# EAGLE design chaves_30 (EAGLE 7.6.0)
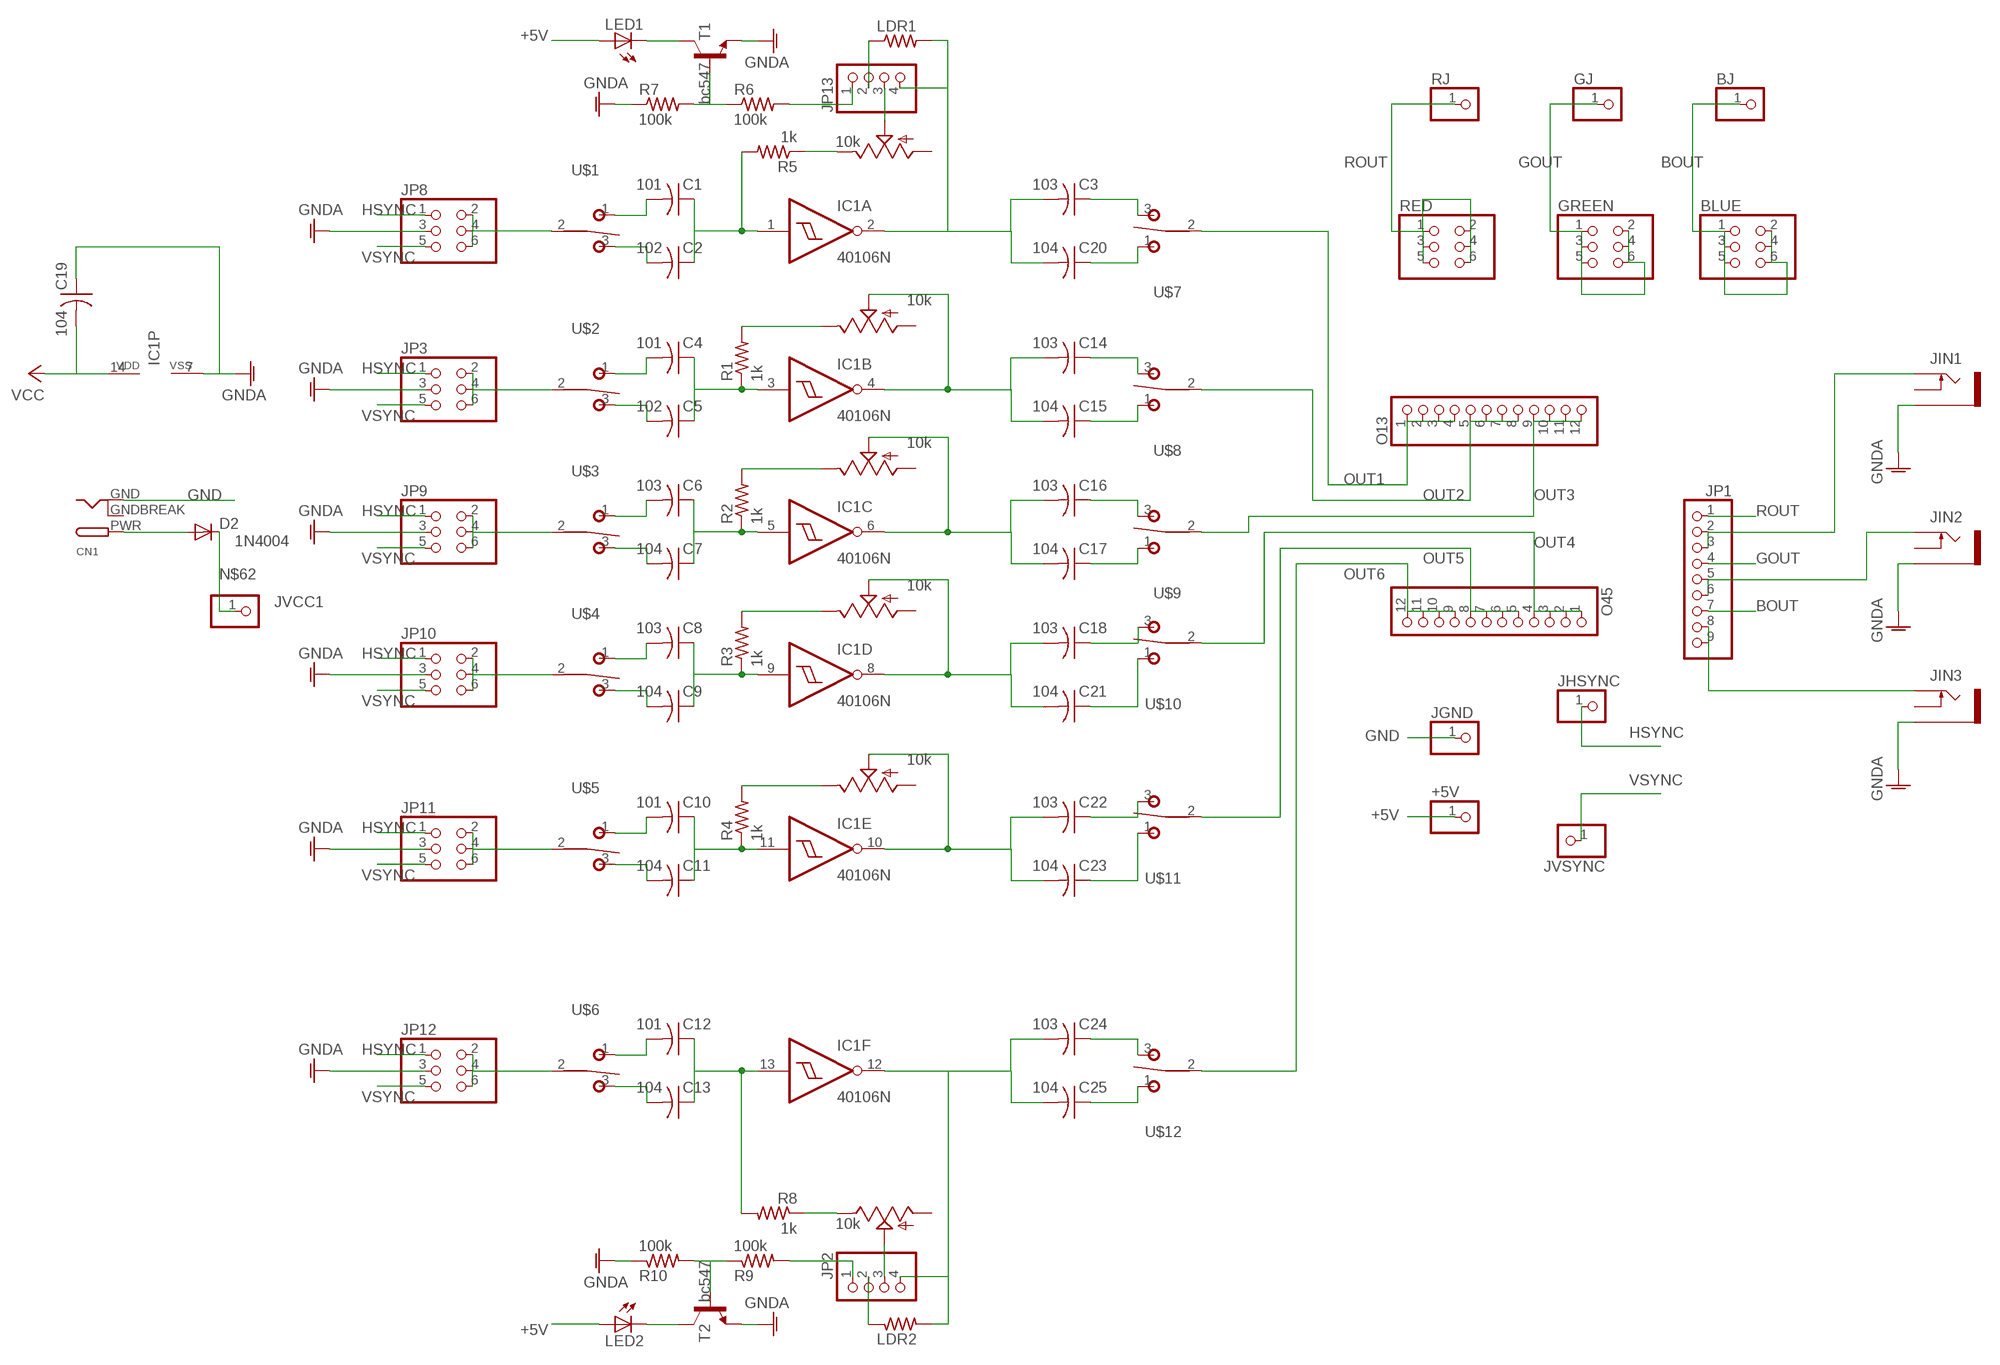
[diagram p0: schematic, sheet 1]

## Parts
+5V  PINHD-1X1  [1X01]
BJ  PINHD-1X1  [1X01]
BLUE  PINHD-2X3  [2X03]
C1  101  C-US050-025X075  [C050-025X075]
C2  102  C-US050-025X075  [C050-025X075]
C3  103  C-US050-025X075  [C050-025X075]
C4  101  C-US050-025X075  [C050-025X075]
C5  102  C-US050-025X075  [C050-025X075]
C6  103  C-US050-025X075  [C050-025X075]
C7  104  C-US050-025X075  [C050-025X075]
C8  103  C-US050-025X075  [C050-025X075]
C9  104  C-US050-025X075  [C050-025X075]
C10  101  C-US050-025X075  [C050-025X075]
C11  104  C-US050-025X075  [C050-025X075]
C12  101  C-US050-025X075  [C050-025X075]
C13  104  C-US050-025X075  [C050-025X075]
C14  103  C-US050-025X075  [C050-025X075]
C15  104  C-US050-025X075  [C050-025X075]
C16  103  C-US050-025X075  [C050-025X075]
C17  104  C-US050-025X075  [C050-025X075]
C18  103  C-US050-025X075  [C050-025X075]
C19  104  C-US050-025X075  [C050-025X075]
C20  104  C-US050-025X075  [C050-025X075]
C21  104  C-US050-025X075  [C050-025X075]
C22  103  C-US050-025X075  [C050-025X075]
C23  104  C-US050-025X075  [C050-025X075]
C24  103  C-US050-025X075  [C050-025X075]
C25  104  C-US050-025X075  [C050-025X075]
CN1  DCBARRELPTH  [DCJACK_2MM_PTH]
D2  1N4004  [DO41-10]
GJ  PINHD-1X1  [1X01]
GREEN  PINHD-2X3  [2X03]
IC1  40106N  [DIL14]
JGND  PINHD-1X1  [1X01]
JHSYNC  PINHD-1X1  [1X01]
JIN1  PJ302M  [PJ302M]
JIN2  PJ302M  [PJ302M]
JIN3  PJ302M  [PJ302M]
JP1  PINHD-1X9  [1X09-BIG]
JP2  PINHD-1X4  [1X04]
JP3  PINHD-2X3  [2X03]
JP8  PINHD-2X3  [2X03]
JP9  PINHD-2X3  [2X03]
JP10  PINHD-2X3  [2X03]
JP11  PINHD-2X3  [2X03]
JP12  PINHD-2X3  [2X03]
JP13  PINHD-1X4  [1X04]
JVCC1  PINHD-1X1  [1X01]
JVSYNC  PINHD-1X1  [1X01]
LDR1  R-US_0204/2V  [0204V]
LDR2  R-US_0204/2V  [0204V]
LED1  LED5MM  [LED5MM]
LED2  LED5MM  [LED5MM]
O13  PINHD-1X12-CB  [1X12-CB]
O45  PINHD-1X12-CB  [1X12-CB]
POT1  10k  POT_USVERTICAL  [ALPS_POT_VERTICAL]
POT2  10k  POT_USVERTICAL  [ALPS_POT_VERTICAL]
POT3  10k  POT_USVERTICAL  [ALPS_POT_VERTICAL]
POT4  10k  POT_USVERTICAL  [ALPS_POT_VERTICAL]
POT5  10k  POT_USVERTICAL  [ALPS_POT_VERTICAL]
POT6  10k  POT_USVERTICAL  [ALPS_POT_VERTICAL]
R1  1k  R-US_0204/2V  [0204V]
R2  1k  R-US_0204/2V  [0204V]
R3  1k  R-US_0204/2V  [0204V]
R4  1k  R-US_0204/2V  [0204V]
R5  1k  R-US_0204/2V  [0204V]
R6  100k  R-US_0204/2V  [0204V]
R7  100k  R-US_0204/2V  [0204V]
R8  1k  R-US_0204/2V  [0204V]
R9  100k  R-US_0204/2V  [0204V]
R10  100k  R-US_0204/2V  [0204V]
RED  PINHD-2X3  [2X03]
RJ  PINHD-1X1  [1X01]
T1  bc547  -NPN-TO92-ECB  [TO92-ECB]
T2  bc547  -NPN-TO92-ECB  [TO92-ECB]
U$1  T-80-T-SPDT-ON-OFF-ON  [M9040P]
U$2  T-80-T-SPDT-ON-OFF-ON  [M9040P]
U$3  T-80-T-SPDT-ON-OFF-ON  [M9040P]
U$4  T-80-T-SPDT-ON-OFF-ON  [M9040P]
U$5  T-80-T-SPDT-ON-OFF-ON  [M9040P]
U$6  T-80-T-SPDT-ON-OFF-ON  [M9040P]
U$7  T-80-T-SPDT-ON-OFF-ON  [M9040P]
U$8  T-80-T-SPDT-ON-OFF-ON  [M9040P]
U$9  T-80-T-SPDT-ON-OFF-ON  [M9040P]
U$10  T-80-T-SPDT-ON-OFF-ON  [M9040P]
U$11  T-80-T-SPDT-ON-OFF-ON  [M9040P]
U$12  T-80-T-SPDT-ON-OFF-ON  [M9040P]

## Nets
+5V: +5V.1 C19.2 IC1.14(P:VDD) LED1.A LED2.A ; supply symbol labelled VCC
BOUT: BJ.1 BLUE.1 BLUE.2 BLUE.3 BLUE.4 BLUE.5 BLUE.6 JP1.7
GND: C19.1 CN1.GND IC1.7(P:VSS) JGND.1 JIN1.GND(SLEEVE) JIN2.GND(SLEEVE) JIN3.GND(SLEEVE) JP3.3 JP8.3 JP9.3 JP10.3 JP11.3 JP12.3 R7.1 R10.1 T1.E T2.E ; supply symbol labelled GNDA
GOUT: GJ.1 GREEN.1 GREEN.2 GREEN.3 GREEN.4 GREEN.5 GREEN.6 JP1.4
HSYNC: JHSYNC.1 JP3.1 JP8.1 JP9.1 JP10.1 JP11.1 JP12.1
N$1: C1.2 U$1.1(O)
N$2: C2.2 U$1.3(S)
N$3: JP13.2 LDR1.1
N$4: C5.2 U$2.3(S)
N$5: C4.2 U$2.1(O)
N$6: JP13.3 POT1.P$2(S)
N$7: C8.2 U$4.1(O)
N$8: C9.2 U$4.3(S)
N$9: JIN1.TIP JP1.2 JP1.3
N$10: C6.2 U$3.1(O)
N$11: C7.2 U$3.3(S)
N$12: JIN2.TIP JP1.5 JP1.6
N$13: JIN3.TIP JP1.8 JP1.9
N$14: JP3.2 JP3.4 JP3.6 U$2.2(P)
N$16: C20.1 U$7.1(O)
N$17: C3.1 U$7.3(S)
N$19: POT1.P$1(E) R5.1
N$20: JP8.2 JP8.4 JP8.6 U$1.2(P)
N$22: POT2.P$1(E) R1.2
N$23: JP9.2 JP9.4 JP9.6 U$3.2(P)
N$24: C15.1 U$8.1(O)
N$26: C14.1 U$8.3(S)
N$28: C17.1 U$9.1(O)
N$29: C16.1 U$9.3(S)
N$31: JP10.2 JP10.4 JP10.6 U$4.2(P)
N$32: R6.1 R7.2 T1.B
N$33: POT3.P$1(E) R2.2
N$34: JP13.1 R6.2
N$35: JP11.2 JP11.4 JP11.6 U$5.2(P)
N$36: JP12.2 JP12.4 JP12.6 U$6.2(P)
N$37: C21.1 U$10.1(O)
N$38: C18.1 U$10.3(S)
N$40: C23.1 U$11.1(O)
N$41: C22.1 U$11.3(S)
N$43: C25.1 U$12.1(O)
N$44: C24.1 U$12.3(S)
N$46: C10.2 U$5.1(O)
N$47: POT4.P$1(E) R3.2
N$48: C11.2 U$5.3(S)
N$49: C13.2 U$6.3(S)
N$50: C12.2 U$6.1(O)
N$52: LED1.K(C) T1.C
N$53: POT5.P$1(E) R4.2
N$55: C24.2 C25.2 IC1.12(F:O) JP2.4 LDR2.2
N$56: JP2.2 LDR2.1
N$57: JP2.3 POT6.P$2(S)
N$58: POT6.P$1(E) R8.1
N$59: R9.1 R10.2 T2.B
N$60: JP2.1 R9.2
N$61: LED2.K(C) T2.C
N$62: D2.C JVCC1.1
N$101: C3.2 C20.2 IC1.2(A:O) JP13.4 LDR1.2
N$102: C14.2 C15.2 IC1.4(B:O) POT2.P$2(S)
N$103: C16.2 C17.2 IC1.6(C:O) POT3.P$2(S)
N$104: C18.2 C21.2 IC1.8(D:O) POT4.P$2(S)
N$105: C22.2 C23.2 IC1.10(E:O) POT5.P$2(S)
OUT1: O13.1 O13.2 O13.3 O13.4 U$7.2(P)
OUT2: O13.5 O13.6 O13.7 O13.8 U$8.2(P)
OUT3: O13.9 O13.10 O13.11 O13.12 U$9.2(P)
OUT4: O45.1 O45.2 O45.3 O45.4 U$10.2(P)
OUT5: O45.5 O45.6 O45.7 O45.8 U$11.2(P)
OUT6: O45.9 O45.10 O45.11 O45.12 U$12.2(P)
ROUT: JP1.1 RED.1 RED.2 RED.3 RED.4 RED.5 RED.6 RJ.1
SS1: C1.1 C2.1 IC1.1(A:I) R5.2
SS2: C4.1 C5.1 IC1.3(B:I) R1.1
SS3: C6.1 C7.1 IC1.5(C:I) R2.1
SS4: C8.1 C9.1 IC1.9(D:I) R3.1
SS5: C10.1 C11.1 IC1.11(E:I) R4.1
SS6: C12.1 C13.1 IC1.13(F:I) R8.2
VIN: CN1.PWR D2.A
VSYNC: JP3.5 JP8.5 JP9.5 JP10.5 JP11.5 JP12.5 JVSYNC.1
Unconnected: JIN1.SW(SWITCH) JIN2.SW(SWITCH) JIN3.SW(SWITCH) POT1.P$3(A) POT2.P$3(A) POT3.P$3(A) POT4.P$3(A) POT5.P$3(A) POT6.P$3(A)

## Power pins joined to a net without a drawn wire
GNDBREAK: CN1.GNDBREAK

## Library data of the parts
+5V BJ GJ JGND JHSYNC JVCC1 JVSYNC RJ = adafruit:PINHD-1X1: Pin header 1x1 for 0.1" spacing With round pins
BLUE GREEN JP3 JP8-JP12 RED = pinhead:PINHD-2X3: PIN HEADER
C1-C25 = adafruit:C-US: CAPACITOR, American symbol
CN1 = adafruit:DCBARREL: 2.0mm DC Barrel Jack DCJACK_2MM_PTH - Through Hole Jack (4UConnector: 05537)
D2 = diode:1N4004: DIODE general purpose rectifier, 1 A
IC1 = 40xx:40106: Hex SCHMITT TRIGGER
JIN1-JIN3 = pj302m:PJ302M: PJ302M horizontal / right angled mount 3.5 mm jack socket
JP1 = adafruit:PINHD-1X9: Pin header 1x10 0.1" spacing With round pins
JP2 JP13 = pinhead:PINHD-1X4: PIN HEADER
LDR1 LDR2 R1-R10 = adafruit:R-US_: RESISTOR, American symbol
LED1 LED2 = adafruit:LED: LED OSRAM: - CHIPLED LG R971, LG N971, LY N971, LG Q971, LY Q971, LO R971, LY R971 LH N974, LH R974 LS Q976, LO Q976, LY Q976 LO Q996 - Hyper CHIPLED LW Q18S LB Q993, LB Q99A, LB R99A - SideLED LS A670, LO A670, LY A670, LG A670, LP A670 LB A673, LV A673, LT A673, LW A673 LH A674 LY A675 LS A676, LA A676, LO A676, LY A676, LW A676 LS A679, LY A679, LG A679 - Hyper Micro SIDELED® LS Y876, LA Y876, LO Y876, LY Y876 LT Y87S - SmartLED LW L88C, LW L88S LB L89C, LB L89S, LG L890 LS L89K, LO L89K, LY L89K LS L896, LA L896, LO L896, LY L896 - TOPLED LS T670, LO T670, LY T670, LG T670, LP T670 LSG T670, LSP T670, LSY T670, LOP T670, LYG T670 LG T671, LOG T671, LSG T671 LB T673, LV T673, LT T673, LW T673 LH T674 LS T676, LA T676, LO T676, LY T676, LB T676, LH T676, LSB T676, LW T676 LB T67C, LV T67C, LT T67C, LS T67K, LO T67K, LY T67K, LW E67C LS E67B, LA E67B, LO E67B, LY E67B, LB E67C, LV E67C, LT E67C LW T67C LS T679, LY T679, LG T679 LS T770, LO T770, LY T770, LG T770, LP T770 LB T773, LV T773, LT T773, LW T773 LH T774 LS E675, LA E675, LY E675, LS T675 LS T776, LA T776, LO T776, LY T776, LB T776 LHGB T686 LT T68C, LB T68C - Hyper Mini TOPLED® LB M676 - Mini TOPLED Santana® LG M470 LS M47K, LO M47K, LY M47K Source: http://www.osram.convergy.de/
O13 O45 = adafruit:PINHD-1X12: PIN HEADER
POT1-POT6 = pot-alps:POT_US
T1 T2 = MusicThingModular:*-NPN-: NPN Transistror BF959 corrected 2008.03.06
U$1-U$12 = MusicThingModular:T-80-T-SPDT-ON-OFF-ON

## Board
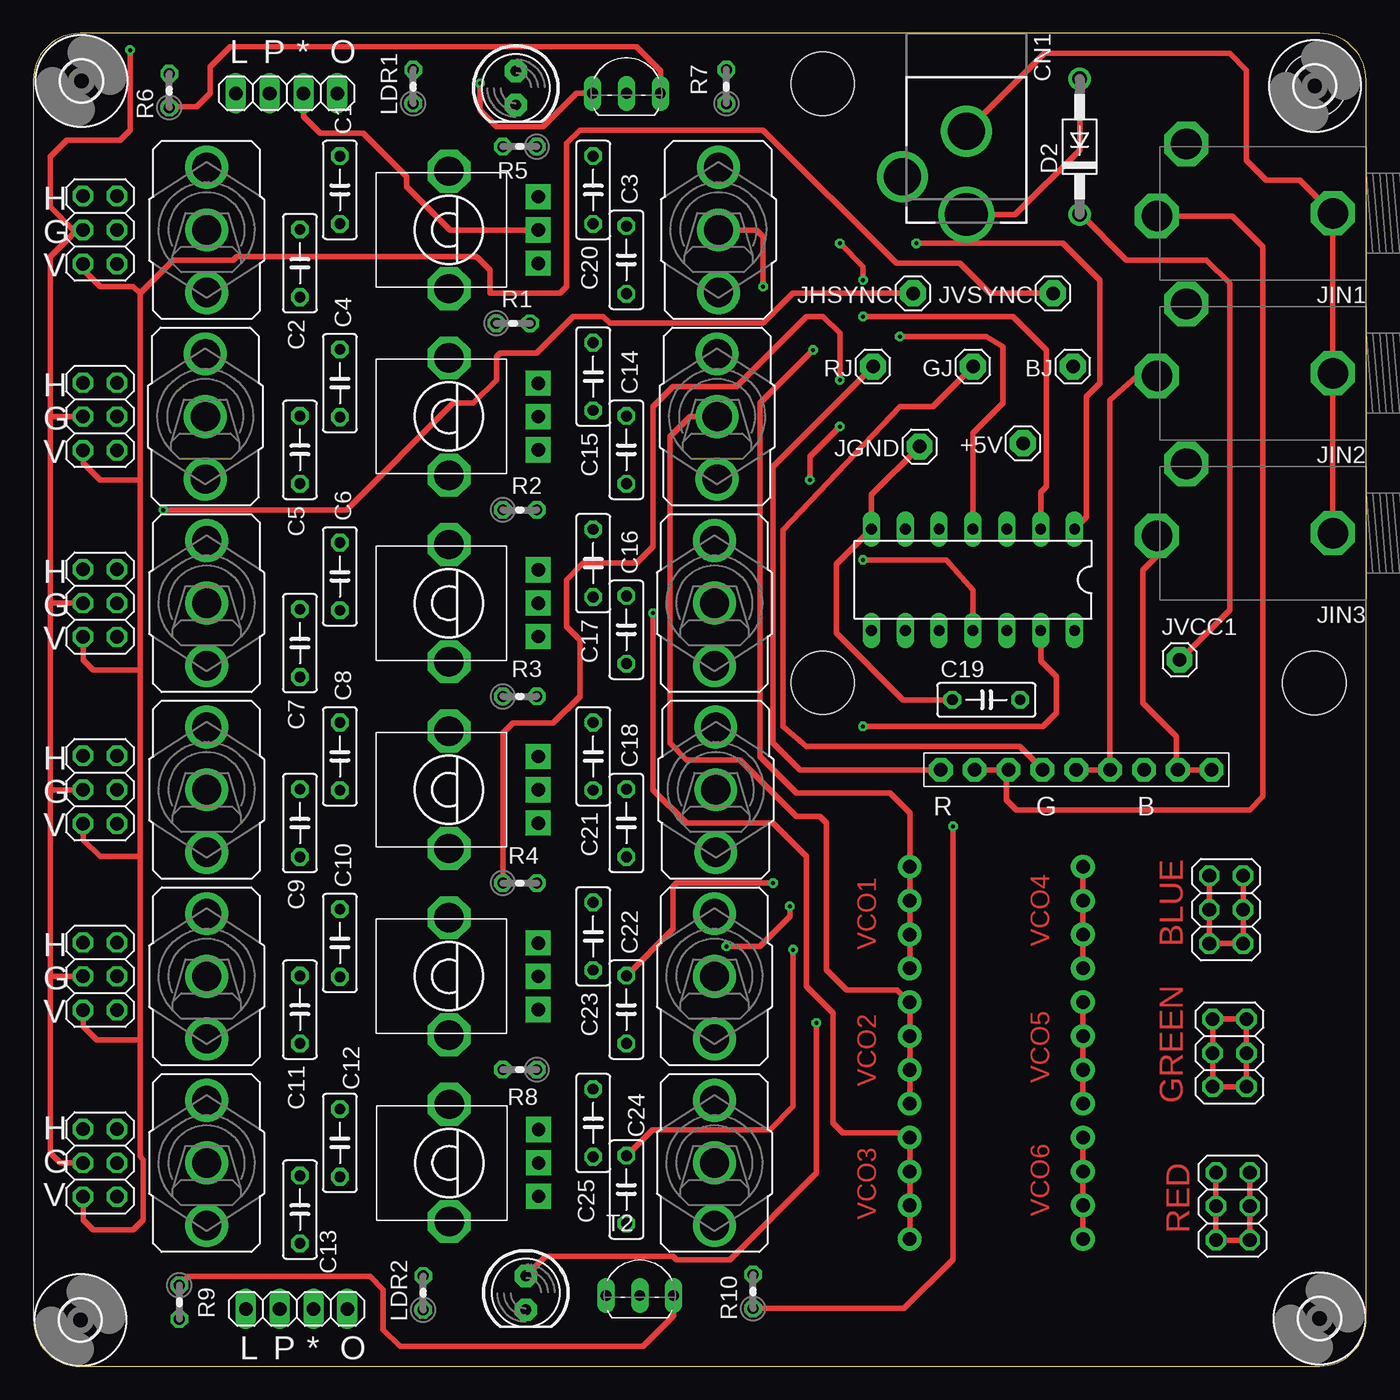
[diagram p1: board, top side]
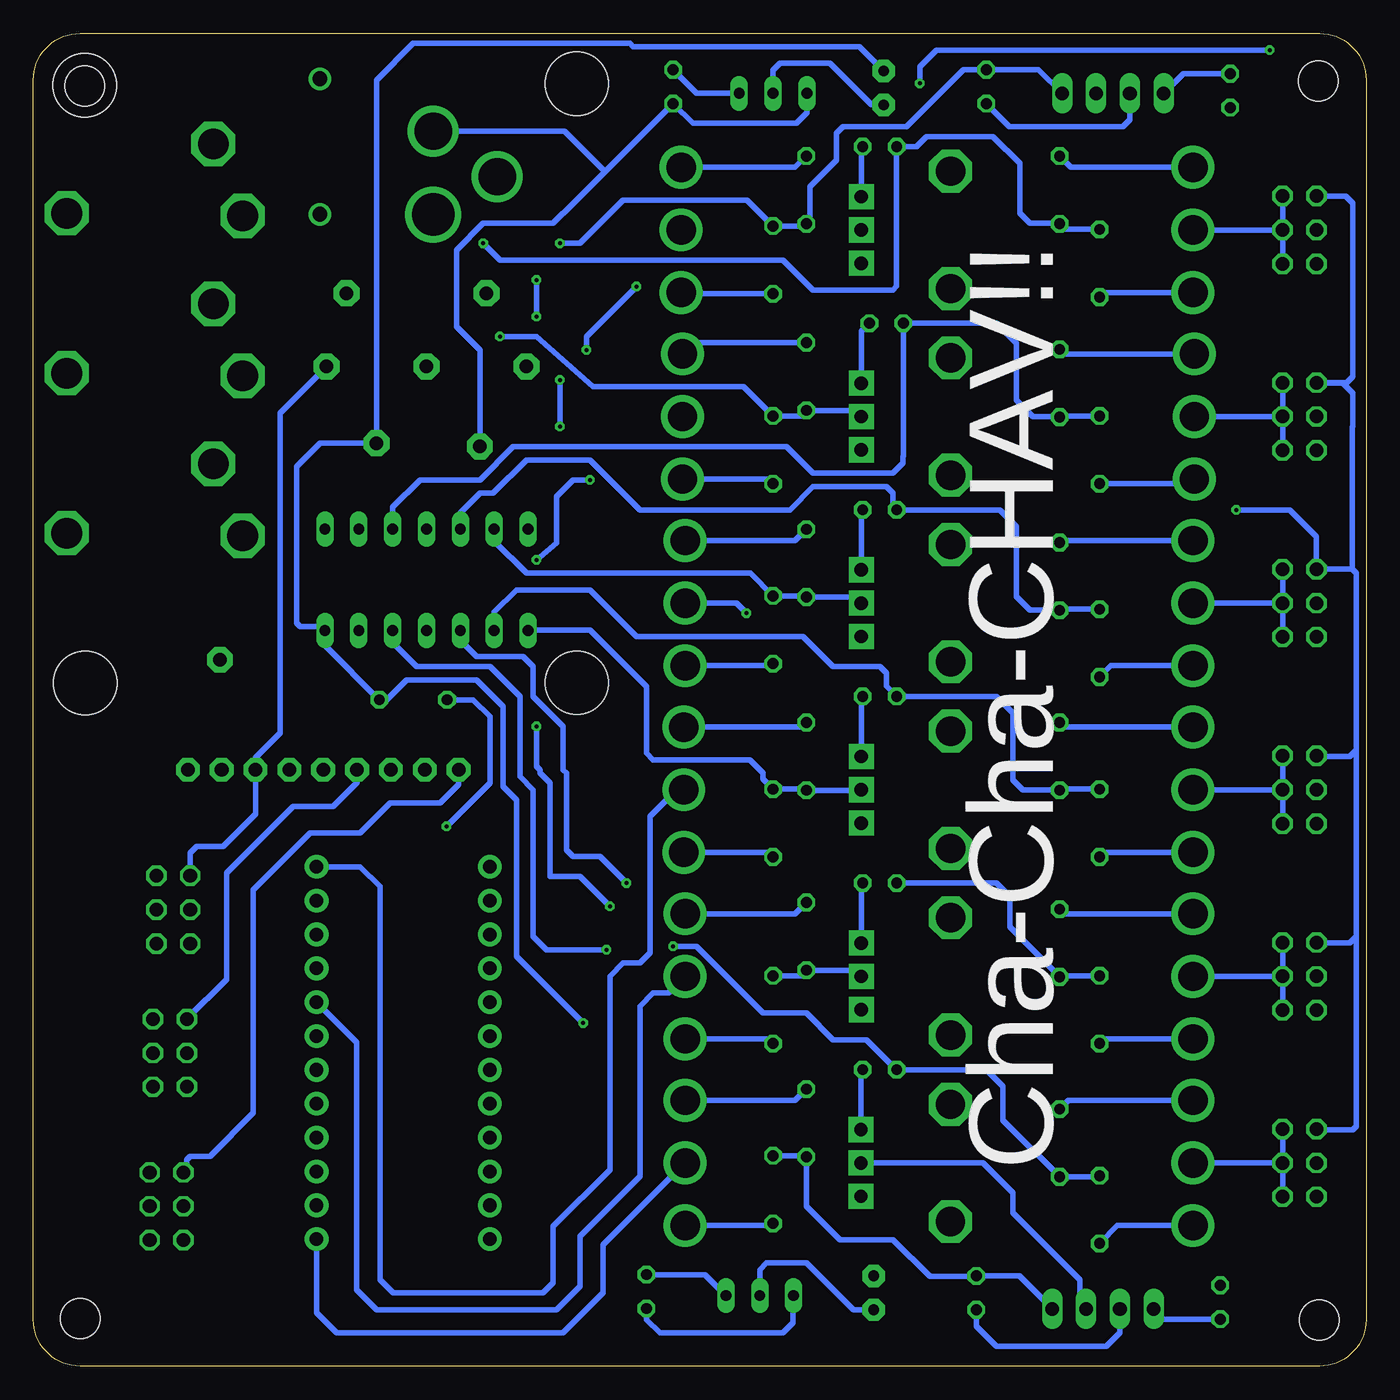
[diagram p2: board, bottom side, seen from below]

Size 100 x 100 mm. Coordinates in mm from the lower left corner, seen from the top.
Outline: 0,96.5 0,3.5 arc90 3.5,0 96.5,0 arc90 100,3.5 100,96.5 arc90 96.5,100 3.5,100 arc90 0,96.5
Copper layers (1*16): Top 0.035mm / dielectric 1.5mm / Bottom 0.035mm
Design rules "default *": minimum track width 10mil, minimum drill 24mil, track to track 8mil, track to pad 8mil, pad to pad 8mil, via to via 8mil, smd to smd 8mil, copper to edge 40mil, drill to drill 8mil, minimum pad ring 10mil, minimum via ring 8mil, stop-mask expansion 4mil, vias tented up to drill 0.3mm, thermal gap 10mil

### Footprints (pad centres in the part's own frame; a part is rotated, then mirrored left to right if it is on the bottom)
1X01 = drill 1.016 pad 1.93 octagon: 1 0,0
2X03 = drill 1.016 octagon: 1 -2.54,-1.27; 2 -2.54,1.27; 3 0,-1.27; 4 0,1.27; 5 2.54,-1.27; 6 2.54,1.27
C050-025X075 = drill 0.813 octagon: 1 -2.54,0; 2 2.54,0
DCJACK_2MM_PTH = drill 2.8: GND 0,7.35; GNDBREAK 4.8,10.75 | drill 3.2: PWR 0,13.6
DO41-10 = drill 1.118: A 5.08,0; C -5.08,0
DRILL_0.1875 = hole 4.762: 0,0
3,0 = hole 3: 0,0
DIL14 = drill 0.813 long: 1 -7.62,-3.81; 2 -5.08,-3.81; 3 -2.54,-3.81; 4 0,-3.81; 5 2.54,-3.81; 6 5.08,-3.81; 7 7.62,-3.81; 8 7.62,3.81; 9 5.08,3.81; 10 2.54,3.81; 11 0,3.81; 12 -2.54,3.81; 13 -5.08,3.81; 14 -7.62,3.81
PJ302M = drill 2.3 pad 3.3 octagon: GND 2.5,0; SW 13.5,-5.2; TIP 15.7,0.2
1X09-BIG = drill 1.016 pad 1.778 octagon: 1 -10.16,0; 2 -7.62,0; 3 -5.08,0; 4 -2.54,0; 5 0,0; 6 2.54,0; 7 5.08,0; 8 7.62,0; 9 10.16,0
1X04 = drill 1.016 long: 1 -3.81,0; 2 -1.27,0; 3 1.27,0; 4 3.81,0
0204V = drill 0.813 octagon: 1 -1.27,0; 2 1.27,0
LED5MM = drill 0.813 pad 1.676 octagon: A -1.27,0; K 1.27,0
1X12-CB = drill 1.016 pad 1.778: 1 -13.97,0; 2 -11.43,0; 3 -8.89,0; 4 -6.35,0; 5 -3.81,0; 6 -1.27,0; 7 1.27,0; 8 3.81,0; 9 6.35,0; 10 8.89,0; 11 11.43,0; 12 13.97,0
ALPS_POT_VERTICAL = drill 1 pad 1.88 square: P$1 -2.5,6.7; P$2 0,6.7; P$3 2.5,6.7 | drill 2.2 pad 3.175 octagon: P$4 -4.4,0; P$5 4.4,0
TO92-ECB = drill 0.813 long: B 2.54,0; C 0,0; E -2.54,0
M9040P = drill 2.2: 1 0,4.699 | drill 2.2 pad 3: 2 0,0; 3 0,-4.699

### Placement (x,y rotation side)
+5V  74.25,69.25 90 top
BJ  78,75 180 top
BLUE  89.5,34.25 90 top
C1  23,88.25 90 top
C2  20,82.75 270 top
C3  44.5,83 90 top
C4  23,73.75 90 top
C5  20,68.75 270 top
C6  23,59.25 90 top
C7  20,54.25 270 top
C8  23,45.75 90 top
C9  20,40.75 270 top
C10  23,31.75 90 top
C11  20,26.75 270 top
C12  23,16.75 90 top
C13  20,11.75 270 top
C14  44.5,68.75 90 top
C15  42,74.25 270 top
C16  44.5,55.25 90 top
C17  42,60.25 270 top
C18  44.5,40.75 90 top
C19  71.5,50 0 top
C20  42,88.25 270 top
C21  42,45.75 270 top
C22  44.5,26.75 90 top
C23  42,32.25 270 top
C24  44.5,13.25 90 top
C25  42,18.25 270 top
CN1  70,100 180 top
D2  78.5,91.5 90 top
E$1  [DRILL_0.1875]  59.23,96.21 0 top
E$2  [DRILL_0.1875]  96.15,96.1 0 top
E$3  [DRILL_0.1875]  96.11,51.25 0 top
E$4  [DRILL_0.1875]  59.23,51.27 0 top
E$5  [3,0]  3.52,3.45 0 top
E$6  [3,0]  96.49,3.58 0 top
E$7  [3,0]  3.6,96.42 0 top
E$8  [3,0]  96.15,96.06 0 top
GJ  70.5,75 180 top
GREEN  89.75,23.5 90 top
IC1  70.5,59 180 top
JGND  66.5,69 90 top
JHSYNC  66,80.5 90 top
JIN1  100,86.5 180 top
JIN2  100,74.5 180 top
JIN3  100,62.5 180 top
JP1  78.25,44.75 0 top
JP2  19.75,4.3 0 top
JP3  5,71.25 270 top
JP8  5,85.25 270 top
JP9  5,57.25 270 top
JP10  5,43.25 270 top
JP11  5,29.25 270 top
JP12  5,15.25 270 top
JP13  19,95.5 0 top
JVCC1  86,53 0 top
JVSYNC  76.5,80.5 90 top
LDR1  28.5,96 90 top
LDR2  29.25,5.5 90 top
LED1  36.2,95.9 270 top
LED2  36.95,5.5 270 top
O13  65.75,23.5 270 top
O45  78.75,23.5 270 top
POT1  31.18,85.25 270 top
POT2  31.18,71.25 270 top
POT3  31.18,57.25 270 top
POT4  31.18,43.25 270 top
POT5  31.18,29.25 270 top
POT6  31.2,15.25 270 top
R1  36,78.25 0 top
R2  36.5,64.25 0 top
R3  36.5,50.25 0 top
R4  36.5,36.25 0 top
R5  36.5,91.5 180 top
R6  10.2,95.7 90 top
R7  52,96 90 top
R8  36.5,22.25 180 top
R9  10.95,4.8 270 top
R10  54,5.6 90 top
RED  90,12 90 top
RJ  63,75 180 top
T1  44.5,95.5 0 top
T2  45.5,5.3 0 top
U$1  13,85.25 0 top
U$2  12.9,71.25 0 top
U$3  13,57.25 0 top
U$4  13,43.25 0 top
U$5  13,29.25 0 top
U$6  13,15.25 0 top
U$7  51.4,85.25 0 top
U$8  51.3,71.25 0 top
U$9  51.1,57.25 0 top
U$10  51.2,43.25 0 top
U$11  51.1,29.25 0 top
U$12  51.1,15.25 0 top

### Tracks (layer width: path | path; a pad name or v marks a point on that pad's centre or on a via)
+5V  (via drill 0.3)
  Top 0.406: LED2.A 38.43,8.25 48,8.25 48.25,8 52.25,8 58.75,14.5 v58.75,25.75
  Bottom 0.406: LED1.A 38.03,99 55,99 55.25,99.25 71.5,99.25 74.25,96.5 +5V.1 78.5,69.25 80.25,67.5 80.25,55.75 80,55.5 78.43,55.5 IC1.14 78.12,54.08 C19.2 73.5,50 72,51.5 66.75,51.5 64.75,49.5 64.75,43.5 63.75,42.5 63.75,30.75 v58.75,25.75
BOUT
  Top 0.406: BLUE.6 BLUE.4 | BLUE.4 BLUE.2 BLUE.1 BLUE.3 BLUE.5 | 88.25,36.79 88.25,36.75 88.23,36.75 BLUE.4
  Bottom 0.406: BJ.1 81.5,71.5 81.5,47.5 83.33,45.67 JP1.7 83.33,41.42 85.75,39 87.75,39 88.25,38.5 88.25,36.81 BLUE.6
GND  (via drill 0.3)
  Top 0.406: JIN3.GND JIN2.GND JIN1.GND 95,89 92.5,89 91,90.5 91,97.25 89.75,98.5 75.85,98.5 CN1.GND | JGND.1 62.88,65.38 IC1.7 60.25,60.18 60.25,55 65.25,50 C19.1 | R10.1 65.33,4.33 69,8 v69,40.5 | JP12.3 2,15.25 1.25,16 1.25,29.25 | 1.25,29.25 1.25,43.25 | 1.25,43.25 1.25,57.25 | 1.25,57.25 1.25,71.25 | 1.25,71.25 1.25,83.25 3.25,85.25 JP8.3 3,85.25 1.25,87 1.25,90.75 2.5,92 6.5,92 7.25,92.75 v7.25,98.75 | JP3.3 1.25,71.25 | JP9.3 1.25,57.25 | JP11.3 1.25,29.25 | JP10.3 1.25,43.25 | v33.5,96.25 33.5,94.25 34.75,93 38.25,93 40.75,95.5 T1.E
  Bottom 0.406: T2.E 43,5.26 43,3.25 43.75,2.5 53,2.5 54,3.5 R10.1 | T1.E 41.96,94.04 42.75,93.25 50.52,93.25 R7.1 57.12,89.61 | JGND.1 66.5,76.25 68.25,78 68.25,83.75 66.25,85.75 61,85.75 60.25,86.5 60.23,86.5 57.12,89.61 | v69,40.5 65.75,43.75 65.75,48.75 67,50 C19.1 | v7.25,98.75 32.25,98.75 33.5,97.5 v33.5,96.25 | CN1.GND 60.15,92.65 57.12,89.61
GOUT
  Top 0.406: GREEN.6 GREEN.4 | GREEN.4 GREEN.2 GREEN.1 GREEN.3 GREEN.5 88.5,26.04 88.5,26 88.48,26 GREEN.4 | GJ.1 67.5,72 65,72 56.25,62.75 56.25,48 58,46.5 74,46.5 75.71,44.79 JP1.4
  Bottom 0.406: GREEN.6 85.5,29.02 85.5,37 80.5,42 77.5,42 75.71,43.79 JP1.4
HSYNC  (via drill 0.3)
  Top 0.406: JHSYNC.1 57,80.5 54.75,78.25 43.25,78.25 42.75,78.75 40.5,78.75 37.75,76 35,76 34.75,75.75 34.75,74 33,72.25 31.5,72.25 23.5,64.25 v9.75,64.25
  Bottom 0.406: JP8.1 1.54,87.79 1,87.25 1,74.25 1.46,73.79 JP3.1 3.69,73.75 1.75,73.75 1,73 1,70.5 1.04,70.46 1.04,59.79 | JP10.1 3.69,45.75 1.25,45.75 0.75,46.25 | 0.75,46.25 0.75,59.5 1.04,59.79 | 1.04,59.79 JP9.1 3.73,62.23 5.75,64.25 v9.75,64.25 | JP11.1 3.69,31.75 1.25,31.75 0.75,32.25 | 0.75,32.25 0.75,46.25 | JP12.1 3.69,17.75 1,17.75 0.75,18 0.75,32.25
N$1
  Bottom 0.406: U$1.1 22.16,89.95 C1.2
N$2
  Bottom 0.406: U$1.3 19.66,80.55 C2.2
N$3
  Bottom 0.406: JP13.2 17.73,93.52 18.25,93 26.77,93 LDR1.1
N$4
  Bottom 0.406: U$2.3 13.24,66.21 C5.2
N$5
  Bottom 0.406: U$2.1 22.66,75.95 C4.2
N$6
  Top 0.406: POT1.P$2 31.25,85.25 28,88.5 28,89.25 24.75,92.5 21.5,92.5 20.27,93.73 JP13.3
N$7
  Bottom 0.406: U$4.1 22.66,47.95 C8.2
N$8
  Bottom 0.406: U$4.3 19.66,38.55 C9.2
N$9
  Top 0.406: JP1.2 JP1.3 73,44.58 73,42.5 73.75,41.75 91.25,41.75 92.25,42.75 92.25,84 89.95,86.3 JIN1.TIP
N$10
  Bottom 0.406: U$3.1 22.84,61.95 C6.2
N$11
  Bottom 0.406: U$3.3 19.16,52.55 C7.2
N$12
  Top 0.406: JP1.5 JP1.6 80.75,44.79 80.75,72.5 82.8,74.3 JIN2.TIP
N$13
  Top 0.406: JP1.9 JP1.8 85.75,44.87 85.75,47.25 83.25,49.75 83.25,59.75 84.3,60.8 JIN3.TIP
N$14
  Bottom 0.406: JP3.2 JP3.4 | JP3.4 JP3.6 | JP3.4 U$2.2
N$16
  Bottom 0.406: C20.1 42.84,89.95 U$7.1
N$17
  Bottom 0.406: C3.1 51.31,80.46 U$7.3
N$19
  Bottom 0.406: POT1.P$1 37.88,91.39 R5.1
N$20
  Bottom 0.406: JP8.6 JP8.4 | JP8.4 JP8.2 | JP8.4 U$1.2
N$22
  Bottom 0.406: POT2.P$1 37.88,77.64 R1.2
N$23
  Bottom 0.406: JP9.2 JP9.4 | JP9.4 JP9.6 | JP9.4 U$3.2
N$24
  Bottom 0.406: C15.1 50.46,76.79 U$8.1
N$26
  Bottom 0.406: C14.1 44.84,66.55 U$8.3
N$28
  Bottom 0.406: C17.1 42.84,61.95 U$9.1
N$29
  Bottom 0.406: C16.1 44.66,52.55 U$9.3
N$31
  Bottom 0.406: JP10.2 JP10.4 | JP10.4 JP10.6 | JP10.4 U$4.2
N$32
  Top 0.406: R6.1 10.27,94.5 12.25,94.5 13.25,95.5 13.25,97.5 14.75,99 45.25,99 47.04,97.21 T1.B
  Bottom 0.406: T1.B 50.23,95.5 R7.2
N$33
  Bottom 0.406: POT3.P$1 37.88,64.14 R2.2
N$34
  Bottom 0.406: R6.2 13.72,96.97 JP13.1
N$35
  Bottom 0.406: JP11.2 JP11.4 | JP11.4 JP11.6 | JP11.4 U$5.2
N$36
  Bottom 0.406: JP12.2 JP12.4 | JP12.4 JP12.6 | JP12.4 U$6.2
N$37
  Bottom 0.406: C21.1 42.34,47.95 U$10.1
N$38
  Bottom 0.406: C18.1 44.84,38.55 U$10.3
N$40
  Bottom 0.406: C23.1 42.84,33.95 U$11.1
N$41
  Bottom 0.406: C22.1 44.84,24.55 U$11.3
N$43
  Bottom 0.406: C25.1 42.84,19.95 U$12.1
N$44
  Bottom 0.406: C24.1 44.66,10.55 U$12.3
N$46
  Bottom 0.406: U$5.1 22.66,33.95 C10.2
N$47
  Bottom 0.406: POT4.P$1 37.88,50.14 R3.2
N$48
  Bottom 0.406: U$5.3 19.66,24.55 C11.2
N$49
  Bottom 0.406: U$6.3 18.66,10.55 C13.2
N$50
  Bottom 0.406: U$6.1 22.34,19.95 C12.2
N$52
  Bottom 0.406: T1.C 44.5,97.25 44,97.75 40.25,97.75 37.13,94.63 LED1.K
N$53
  Bottom 0.406: POT5.P$1 37.88,36.14 R4.2
N$55  (via drill 0.3)
  Top 0.406: C24.2 46.46,17.75 55.25,17.75 57,19.5 v57,31.25
  Bottom 0.406: JP2.4 26.03,6.77 LDR2.2 29.27,6.75 32.75,6.75 35.5,9.5 39.5,9.5 42,12 C25.2 42.08,15.79 C24.2 | v57,31.25 61.5,31.25 62.5,32.25 62.5,43.25 63.5,44.25 63.5,50.25 65.75,52.5 71.25,52.5 73.04,54.29 IC1.12
N$56
  Bottom 0.406: LDR2.1 29.25,3 27.75,1.5 19.5,1.5 18.48,2.52 JP2.2
N$57
  Bottom 0.406: POT6.P$2 28.75,15.25 26.5,13 26.5,11.5 21.5,6.5 21.5,4.78 JP2.3
N$58
  Bottom 0.406: POT6.P$1 37.9,22.12 R8.1
N$59
  Top 0.406: R9.1 11.63,6.75 25.25,6.75 26.25,5.75 26.25,2.75 27.5,1.5 45.75,1.5 48.04,3.79 T2.B
  Bottom 0.406: T2.B 49.61,6.87 R10.2
N$60
  Bottom 0.406: R9.2 15.17,3.53 JP2.1
N$61
  Bottom 0.406: T2.C 45.5,7.25 45,7.75 42,7.75 38.48,4.23 LED2.K
N$62
  Top 0.406: JVCC1.1 89.75,56.75 89.75,81.25 88,83 82,83 78.58,86.42 D2.C
N$101  (via drill 0.3)
  Top 0.406: v60.5,84.25 62.25,82.5 v62.25,81.5 | v62.25,78.75 73.5,78.75 76,76.25 76,66 75.58,65.58 IC1.2
  Bottom 0.406: JP13.4 24.58,97.27 LDR1.2 30.23,97.27 34.5,93 39.25,93 39.75,92.5 39.75,90.5 41.75,88.5 41.75,85.96 C20.2 42.17,85.54 C3.2 46.46,87.5 55.75,87.5 59,84.25 v60.5,84.25 | v62.25,81.5 v62.25,78.75
N$102  (via drill 0.3)
  Top 0.406: v65,77.25 71.5,77.25 72.75,76.5 72.75,72.25 70.5,70 IC1.4
  Bottom 0.406: POT2.P$2 38.34,71.71 C15.2 42.42,71.29 C14.2 46.71,73.5 58,73.5 62.25,77.25 v65,77.25
N$103
  Bottom 0.406: POT3.P$2 38.34,57.71 C17.2 42.08,57.79 C16.2 46.21,59.5 63,59.5 65.42,61.92 IC1.6
N$104
  Bottom 0.406: POT4.P$2 37.92,43.21 C21.2 42.08,43.29 C18.2 45.25,44.04 45.25,44.5 46.25,45.5 53.5,45.5 54,46 54,51 58.25,55.25 62.82,55.25 IC1.8
N$105  (via drill 0.3)
  Top 0.406: C22.2 48,32.79 48,36 48.25,36.25 v55.5,36.25
  Bottom 0.406: C22.2 42.42,29.29 C23.2 38.34,29.71 POT5.P$2 | v55.5,36.25 57.5,38.25 59.5,38.25 60,38.75 60,44.5 60.25,44.75 60.25,48 62.5,50.25 62.5,52.5 63.25,53.25 66.75,53.25 67.96,54.46 IC1.10
OUT1  (via drill 0.3)
  Top 0.406: O13.4 O13.3 O13.2 O13.1 65.75,41.5 64.25,43 57.25,43 54.5,45.75 54.5,72.25 v58.5,76.25 | U$7.2 54.25,85.25 54.75,84.75 v54.75,81
  Bottom 0.406: v54.75,81 58.5,77.25 v58.5,76.25
OUT2
  Top 0.406: O13.8 O13.7 O13.6 O13.5 64.81,28.25 61,28.25 59.5,29.75 59.5,40.75 59,41.25 57.25,41.25 53,45.5 49,45.5 47.75,46.75 47.75,69.75 49.25,71.25 U$8.2
OUT3  (via drill 0.3)
  Top 0.406: O13.12 O13.11 O13.10 O13.9 65.4,17.5 60.75,17.5 60,18.25 60,26.5 58,28.5 58,38.25 55.5,40.75 49,40.75 46.5,43.25 v46.5,56.5
  Bottom 0.406: v46.5,56.5 47.25,57.25 U$9.2
OUT4
  Top 0.406: O45.4 O45.3 O45.2 O45.1
  Bottom 0.406: O45.1 75.47,37.47 74,36 74,6.5 73,5.5 61.75,5.5 61,6.25 61,10.5 56.75,14.75 56.75,29.25 55.75,30.25 54.5,30.25 53.75,31 53.75,41.25 52.5,42.5 51.95,42.5 U$10.2
OUT5
  Top 0.406: O45.8 O45.7 O45.6 O45.5
  Bottom 0.406: O45.5 75.75,24.31 75.75,5.75 74.25,4.25 60.75,4.25 59,6 59,9.75 54.5,14.25 54.5,27 53.5,28 52.35,28 U$11.2
OUT6
  Top 0.406: O45.12 O45.11 O45.10 O45.9
  Bottom 0.406: U$12.2 57.25,9.1 57.25,5.5 60.25,2.5 77.25,2.5 78.75,4 O45.12
ROUT
  Top 0.406: RED.6 RED.4 | RED.4 RED.2 RED.1 RED.3 RED.5 | 88.75,14.54 88.75,14.5 88.73,14.5 RED.4 | RJ.1 55.5,67.5 55.5,46.75 57.5,44.75 JP1.1
  Bottom 0.406: JP1.1 68.09,43.66 69.5,42.25 73.25,42.25 75.5,40 79.25,40 83.5,35.75 83.5,19 86.75,15.75 88.25,15.75 88.5,15.5 88.5,14.77 RED.6
SS1  (via drill 0.3)
  Top 0.406: v66.25,84.25 77.25,84.25 80,81.5 80,73.75 79,72.75 79,63.69 IC1.1
  Bottom 0.406: C2.1 22.58,85.29 C1.1 23.04,85.75 25.25,85.75 26,86.5 26,90.25 28,92.25 33,92.25 33.75,91.5 R5.2 35.23,81.02 35.5,80.75 41.5,80.75 43.75,83 65,83 v66.25,84.25
SS2
  Bottom 0.406: C5.1 22.92,71.29 C4.1 23.04,71.25 25,71.25 26.25,72.5 26.25,76.75 27.75,78.25 R1.1 34.73,68.27 34.75,68.25 34.75,67.75 35.5,67 41.5,67 43.5,69 64,69 66.5,66.5 71,66.5 73.04,64.46 IC1.3
SS3
  Bottom 0.406: C7.1 22.92,56.79 C6.1 23.04,56.75 25.25,56.75 26.25,57.75 26.25,63 27.5,64.25 R2.1 35.5,64.52 35.5,65.5 36,66 41.5,66 43.25,64.25 54.5,64.25 58.25,68 63,68 65.5,65.5 66.5,65.5 67.96,64.04 IC1.5
SS4
  Bottom 0.406: C9.1 22.92,43.29 C8.1 23.04,43.25 25.75,43.25 26.5,44 26.5,49 27.75,50.25 R3.1 36,51.02 36,52 36.5,52.5 40,52.5 42.25,54.75 54.75,54.75 58.25,58.25 63.75,58.25 65.42,56.58 IC1.9
SS5  (via drill 0.3)
  Top 0.406: R4.1 35.25,36.27 35.25,47.5 36,48.25 39,48.25 41,50.25 41,54.5 40,55.5 40,59 41.25,60.25 45.25,60.25 46.5,61.5 46.5,72 48,73.5 52.75,73.5 58,78.75 59.25,78.75 60.5,77.5 v60.5,74 | IC1.11 70.5,58.25 68.5,60.5 v62.25,60.5 | v58.25,66.5 58.25,68.25 v60.5,70.5
  Bottom 0.406: C11.1 22.92,29.29 C10.1 26.75,32.96 26.75,35.25 27.75,36.25 R4.1 | v62.25,60.5 60.75,61.75 60.75,65.25 59.5,66.5 v58.25,66.5 | v60.5,70.5 v60.5,74
SS6  (via drill 0.3)
  Top 0.406: v52,31.5 54.5,31.5 56.75,33.75 v56.75,34.5 | v62.25,48 75.75,48 76.75,49 76.75,51.75 75.58,52.92 IC1.13
  Bottom 0.406: C13.1 20.08,14.21 C12.1 27.25,18.46 27.25,21 28.5,22.25 R8.2 37.48,24.5 40,24.5 42,26.5 45.25,26.5 50.25,31.5 v52,31.5 | v56.75,34.5 59,36.75 61.25,36.75 61.25,43.75 62,44.5 62,44.75 62.25,45 v62.25,48
VIN
  Top 0.406: CN1.PWR 73.65,86.4 78.5,91.25 D2.A
VSYNC
  Top 0.406: JP12.5 3.75,12.69 3.75,11 4.5,10.25 7.5,10.25 8.25,11 8.25,15.5 8,15.75 8,24.5 | 8,24.5 8,38.25 | 8,38.25 8,52.25 | 8,52.25 8,66.5 | 8,66.5 8,80.5 | 8,80.5 7.5,81 5,81 3.73,82.27 JP8.5 | JP9.5 3.75,54.69 3.75,53 4.5,52.25 8,52.25 | JP10.5 3.75,40.69 3.75,39.5 5,38.25 8,38.25 | JP11.5 3.75,26.69 3.75,25.5 4.75,24.5 8,24.5 | JP3.5 3.75,68.69 3.75,67.75 5,66.5 8,66.5 | JVSYNC.1 71.75,80.5 69.5,82.75 64.75,82.75 54.75,92.75 41,92.75 40,91.75 40,81 39.5,80.5 34.25,80.5 34.25,82.25 33.25,83.25 15.25,83.25 15,83 10.5,83 8,80.5

### Text on the board
Top: VCO4 | VCO1 | VCO2 | VCO5 | VCO3 | VCO6
tNames: L | P | * | O | H | G | V | H | G | V | H | G | V | H | G | R | G | B | V | H | G | V | H | G | V | L | P | * | O
bNames: Cha-Cha-CHAV!!
bValues: version 3 | CHA/V-ES basado en jonasbers.com/chav/ | pcb by luix github.com/Ttreintaysiete/chaves
tStop: VCO4 | BLUE | VCO1 | VCO2 | VCO5 | GREEN | VCO3 | VCO6 | RED